# Altium schematic sheet WiFi Bluetooth ESP-WROOM-32.SchDoc
size 209 x 297 mm; Author: Мурашкин Д.В.; Address1: Address1; Address2: Address2; Address3: Address3; Address4: Address4; DocumentNumber: АБВГ.123456.001 Э3; Scale: 1:1; Letter1Column: Э; PartName: Деталь
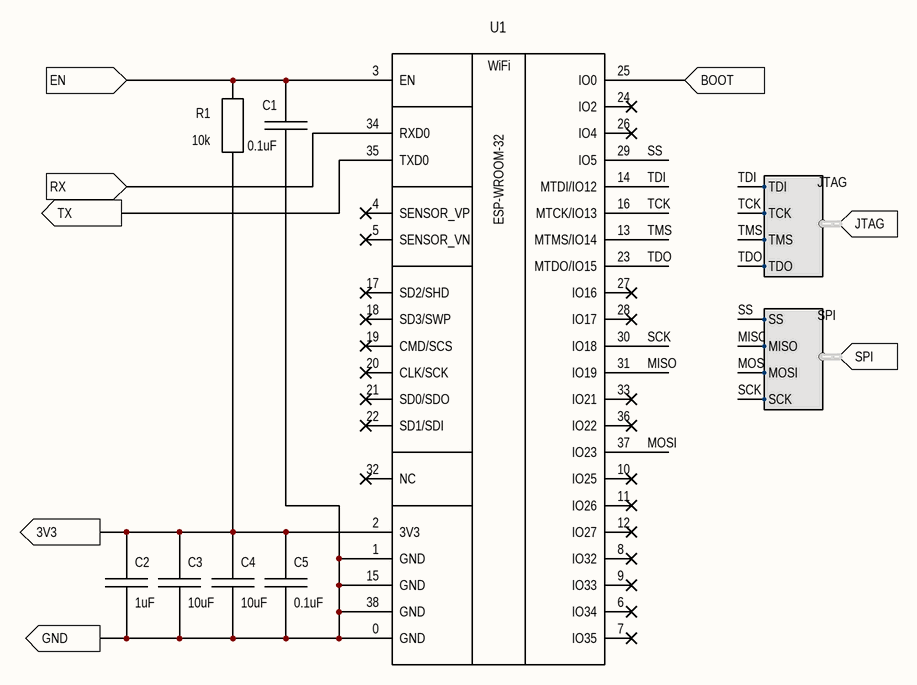
[diagram p0: WiFi Bluetooth ESP-WROOM-32.SchDoc]

## Parts
C1  0.1uF  [CAPC1608L]
C2  1uF  [CAPC1608L]
C3  10uF  [CAPC2012L]
C4  10uF  [CAPC2012L]
C5  0.1uF  [CAPC1608L]
R1  10k  [RESC1608L]
U1  ESP-WROOM-32

## Ports
3V3, BOOT (in), EN (in), GND, JTAG (harness JTAG), RX (in), SPI (harness SPI), TX (out)

## Harnesses
SPI: MISO, MOSI, SCK, SS
JTAG: TDI, TMS, TDO, TCK

## Nets
3V3: C2.1 C3.1 C4.1 C5.1 R1.2 U1.2(3V3) ; port 3V3
BOOT: U1.25(IO0) ; port BOOT
EN: C1.1 R1.1 U1.3(EN) ; port EN
GND: C1.2 C2.2 C3.2 C4.2 C5.2 U1.0(GND) U1.1(GND) U1.15(GND) U1.38(GND) ; port GND
MISO: U1.31(IO19) ; port SPI.MISO
MOSI: U1.37(IO23) ; port SPI.MOSI
RX: U1.34(RXD0) ; port RX
SCK: U1.30(IO18) ; port SPI.SCK
SS: U1.29(IO5) ; port SPI.SS
TCK: U1.16(MTCK/IO13) ; port JTAG.TCK
TDI: U1.14(MTDI/IO12) ; port JTAG.TDI
TDO: U1.23(MTDO/IO15) ; port JTAG.TDO
TMS: U1.13(MTMS/IO14) ; port JTAG.TMS
TX: U1.35(TXD0) ; port TX

Not connected (* = marked no-connect by the designer): U1 4(SENSOR_VP)* 5(SENSOR_VN)* 6(IO34)* 7(IO35)* 8(IO32)* 9(IO33)* 10(IO25)* 11(IO26)* 12(IO27)* 17(SD2/SHD)* 18(SD3/SWP)* 19(CMD/SCS)* 20(CLK/SCK)* 21(SD0/SDO)* 22(SD1/SDI)* 24(IO2)* 26(IO4)* 27(IO16)* 28(IO17)* 32(NC)* 33(IO21)* 36(IO22)*

## Notes on the sheet
- Перв. примен.
- Справ. №
- Подп. и дата
- Инв. № дубл.
- Взам. инв. №
- Разраб.
- Изм.
- Лист
- № докум.
- Подп.
- Дата
- Лит.
- Масса
- Масштаб
- Пров.
- Т.контр.
- Листов
- Инв. № подл.
- Утв.
- Н.контр.
- 2.106-A4
- Копировал
- Формат А4
- (in symbol ESP-WROOM-32) WiFi

## Library data of the parts
C1 C5 = Capacitor Ceramic 0.1uF 25V 0603(1608): Group: Ceramic Capacitors; Temperature Coefficient: X7R; Tolerance: ±10%; Voltage: 25; Type: Ceramic; Package: 0603 (1608); Value: 0.1uF
C2 = Capacitor Ceramic 1uF 25V 0603(1608): Group: Ceramic Capacitors; Temperature Coefficient: X5R; Tolerance: ±10%; Short description: CAP CER 1UF 25V X5R 0603; Type: Ceramic; Voltage: 25V; Package: 0603 (1608); Value: 1uF
C3 C4 = Capacitor Ceramic 10uF 25V 0805(2012): Group: Ceramic Capacitors; Temperature Coefficient: X5R; Tolerance: ±10%; Voltage: 25; Type: Ceramic; Package: 0805 (2012); Value: 10uF
R1 = Resistor Ceramic 10k 0.1W 0603(1608): Group: Resistors; Temperature Coefficient: ±100ppm/°C; Tolerance: ±5%; Type: Thin Film; Power: 0.1W; Package: 0603 (1608); Value: 10k
U1 = ESP-WROOM-32: WiFi/Bluetooth Module based on ESP32; Manufacturer: Espressif; Group: Wireless; Package: ESP-WROOM-32; Part name: ESP-WROOM-32